# EAGLE design MIDItrigger (EAGLE 9.3.1)
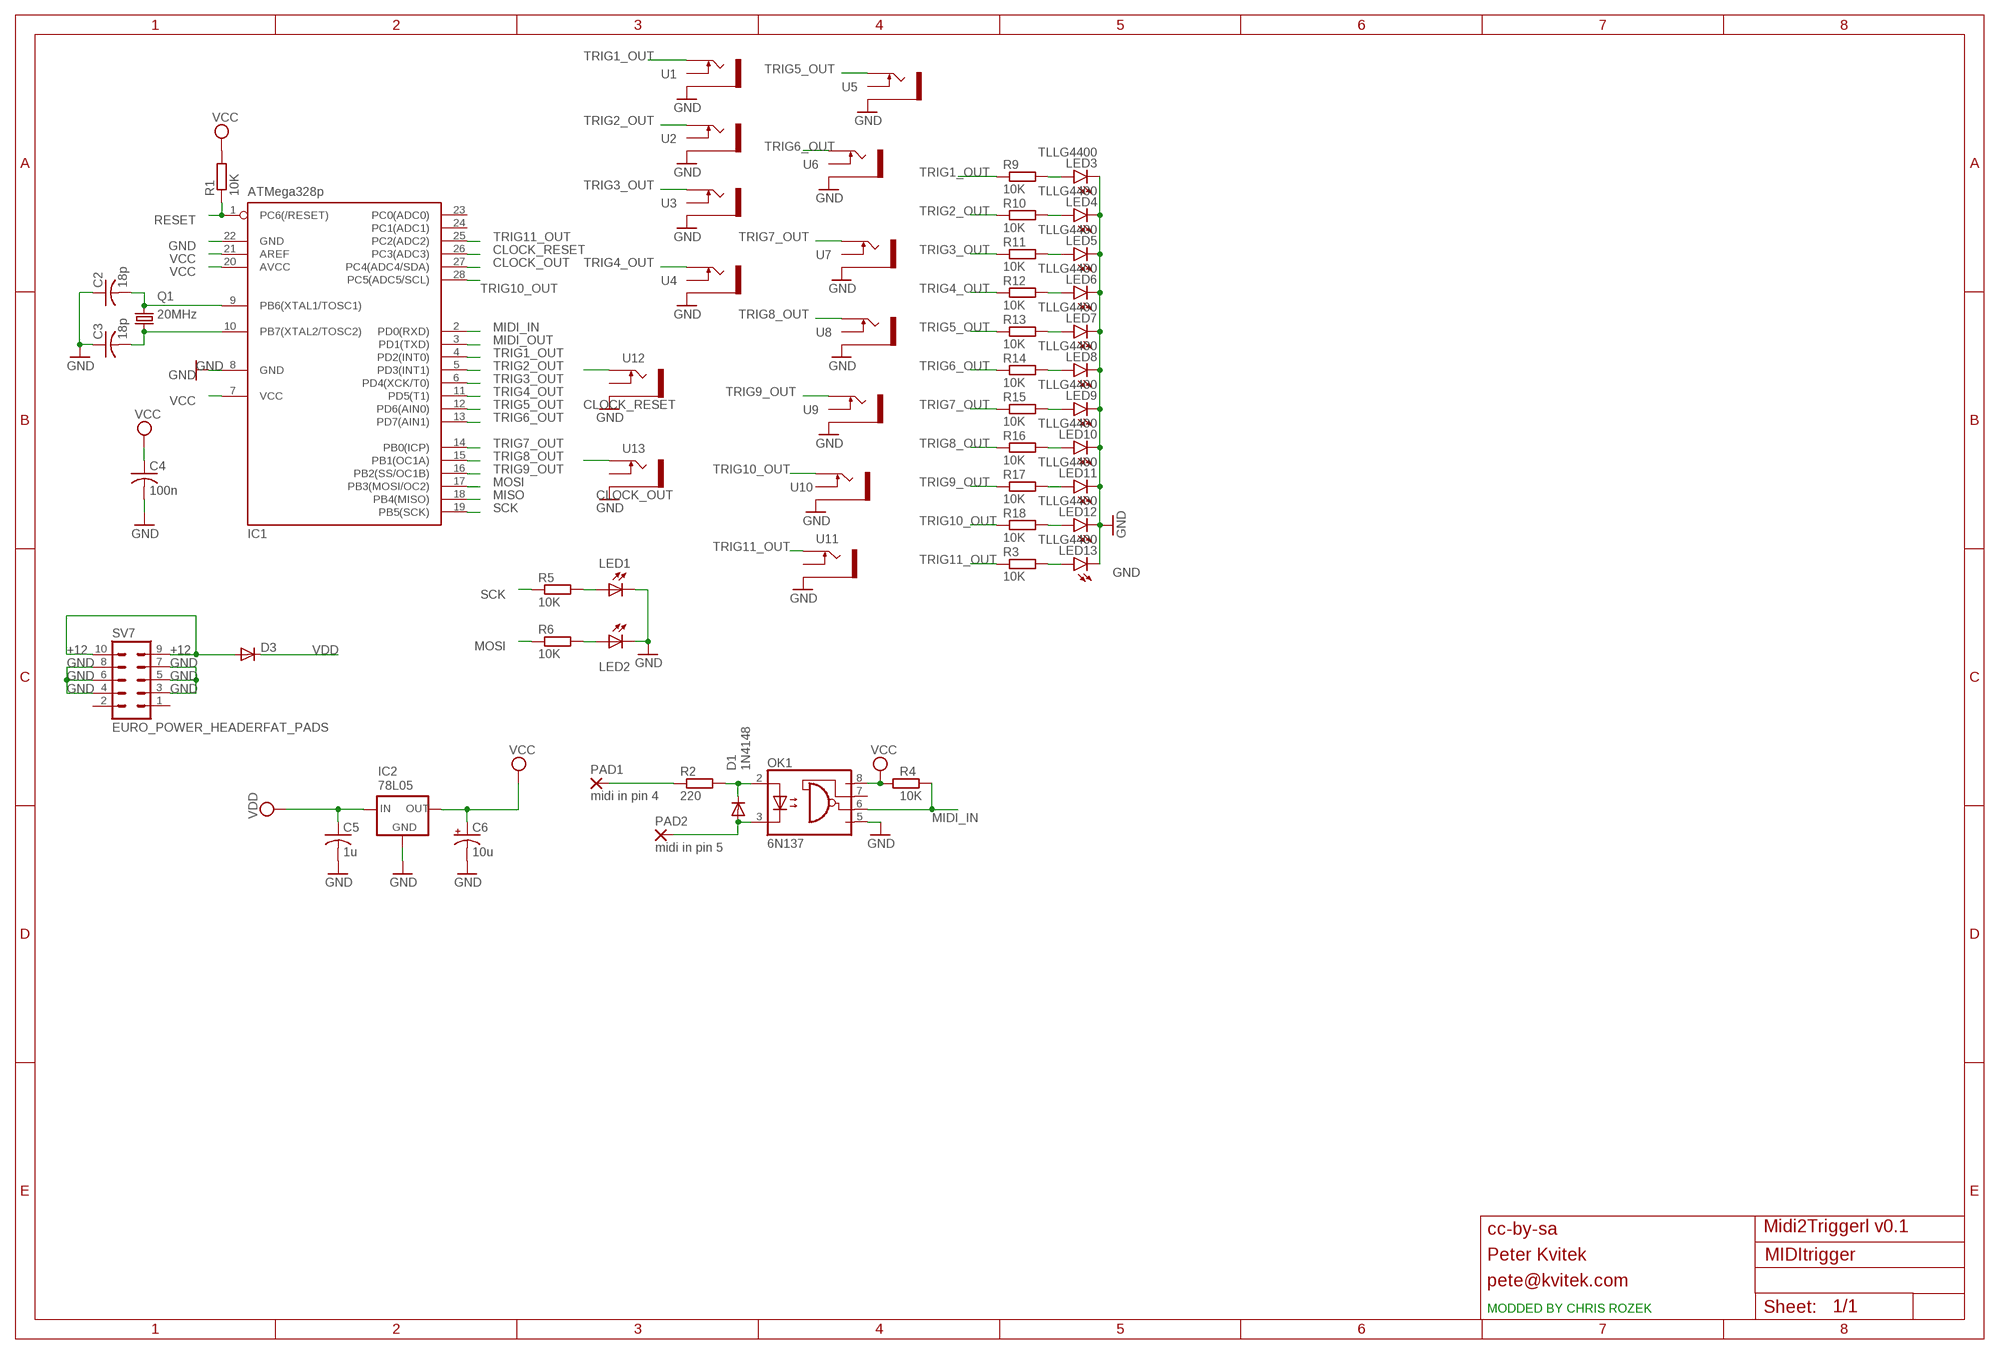
[diagram p0: schematic, sheet 1]

## Parts
C2  18p  C-US025-025X050  [C025-025X050]
C3  18p  C-US025-025X050  [C025-025X050]
C4  100n  C-US025-025X050  [C025-025X050]
C5  1u  C-US025-025X050  [C025-025X050]
C6  10u  CPOL-USE2.5-5  [E2,5-5]
D1  1N4148  SMALL_DIODEDO35-7  [DO35-7]
D3  SMALL_DIODEDO35-7  [DO35-7]
IC1  ATMega328p  MEGA8-P  [DIL28-3]
IC2  78L05  78LXX  [78LXX]
LED1  LED3MM  [LED3MM]
LED2  LED3MM  [LED3MM]
LED3  TLLG4400  [LED3MM]
LED4  TLLG4400  [LED3MM]
LED5  TLLG4400  [LED3MM]
LED6  TLLG4400  [LED3MM]
LED7  TLLG4400  [LED3MM]
LED8  TLLG4400  [LED3MM]
LED9  TLLG4400  [LED3MM]
LED10  TLLG4400  [LED3MM]
LED11  TLLG4400  [LED3MM]
LED12  TLLG4400  [LED3MM]
LED13  TLLG4400  [LED3MM]
OK1  6N137  [DIL08]
PAD1  midi in pin 4  2,54/1,1  [2,54/1,1]
PAD2  midi in pin 5  2,54/1,1  [2,54/1,1]
Q1  20MHz  CRYSTALHC49U-V  [HC49U-V]
R1  10K  RESISTORVERTICAL  [VERTICAL_RESISTOR]
R2  220  RESISTORVERTICAL  [VERTICAL_RESISTOR]
R3  10K  RESISTORVERTICAL  [VERTICAL_RESISTOR]
R4  10K  RESISTORVERTICAL  [VERTICAL_RESISTOR]
R5  10K  RESISTORVERTICAL  [VERTICAL_RESISTOR]
R6  10K  RESISTORVERTICAL  [VERTICAL_RESISTOR]
R9  10K  RESISTORVERTICAL  [VERTICAL_RESISTOR]
R10  10K  RESISTORVERTICAL  [VERTICAL_RESISTOR]
R11  10K  RESISTORVERTICAL  [VERTICAL_RESISTOR]
R12  10K  RESISTORVERTICAL  [VERTICAL_RESISTOR]
R13  10K  RESISTORVERTICAL  [VERTICAL_RESISTOR]
R14  10K  RESISTORVERTICAL  [VERTICAL_RESISTOR]
R15  10K  RESISTORVERTICAL  [VERTICAL_RESISTOR]
R16  10K  RESISTORVERTICAL  [VERTICAL_RESISTOR]
R17  10K  RESISTORVERTICAL  [VERTICAL_RESISTOR]
R18  10K  RESISTORVERTICAL  [VERTICAL_RESISTOR]
SV7  EURO_POWER_HEADERFAT_PADS  [EURO_PWR_HEADER_FAT]
U1  THONKICONNNEW  [WQP-PJ301M-12_JACK]
U2  THONKICONNNEW  [WQP-PJ301M-12_JACK]
U3  THONKICONNNEW  [WQP-PJ301M-12_JACK]
U4  THONKICONNNEW  [WQP-PJ301M-12_JACK]
U5  THONKICONNNEW  [WQP-PJ301M-12_JACK]
U6  THONKICONNNEW  [WQP-PJ301M-12_JACK]
U7  THONKICONNNEW  [WQP-PJ301M-12_JACK]
U8  THONKICONNNEW  [WQP-PJ301M-12_JACK]
U9  THONKICONNNEW  [WQP-PJ301M-12_JACK]
U10  THONKICONNNEW  [WQP-PJ301M-12_JACK]
U11  THONKICONNNEW  [WQP-PJ301M-12_JACK]
U12  THONKICONNNEW  [WQP-PJ301M-12_JACK]
U13  THONKICONNNEW  [WQP-PJ301M-12_JACK]

## Nets
+12: D3.A SV7.9 SV7.10
CLOCK_OUT: IC1.27(PC4(ADC4/SDA)) U13.P$1_TIP(TIP)
CLOCK_RESET: IC1.26(PC3(ADC3)) U12.P$1_TIP(TIP)
GND: C2.1 C3.1 C4.2 C5.2 C6.- IC1.8(GND) IC1.22(GND) IC2.GND LED1.K(C) LED2.K(C) LED3.K(C) LED4.K(C) LED5.K(C) LED6.K(C) LED7.K(C) LED8.K(C) LED9.K(C) LED10.K(C) LED11.K(C) LED12.K(C) LED13.K(C) OK1.5(GND) SV7.3 SV7.4 SV7.5 SV7.6 SV7.7 SV7.8 U1.P$3_SLEEVE(SLEEVE) U2.P$3_SLEEVE(SLEEVE) U3.P$3_SLEEVE(SLEEVE) U4.P$3_SLEEVE(SLEEVE) U5.P$3_SLEEVE(SLEEVE) U6.P$3_SLEEVE(SLEEVE) U7.P$3_SLEEVE(SLEEVE) U8.P$3_SLEEVE(SLEEVE) U9.P$3_SLEEVE(SLEEVE) U10.P$3_SLEEVE(SLEEVE) U11.P$3_SLEEVE(SLEEVE) U12.P$3_SLEEVE(SLEEVE) U13.P$3_SLEEVE(SLEEVE)
MIDI_IN: IC1.2(PD0(RXD)) OK1.6(VO) R4.2
MIDI_OUT: IC1.3(PD1(TXD))
MISO: IC1.18(PB4(MISO))
MOSI: IC1.17(PB3(MOSI/OC2)) R6.1
N$2: D1.C OK1.2(A) R2.2
N$3: LED13.A R3.2
N$4: LED1.A R5.2
N$5: LED2.A R6.2
N$17: LED3.A R9.2
N$18: LED4.A R10.2
N$19: LED5.A R11.2
N$20: LED6.A R12.2
N$21: LED7.A R13.2
N$22: LED8.A R14.2
N$23: LED9.A R15.2
N$24: LED10.A R16.2
N$25: LED11.A R17.2
N$26: LED12.A R18.2
N$72: PAD1.1(P) R2.1
N$73: D1.A OK1.3(C) PAD2.1(P)
N$82: C3.2 IC1.10(PB7(XTAL2/TOSC2)) Q1.1
N$83: C2.2 IC1.9(PB6(XTAL1/TOSC1)) Q1.2
RESET: IC1.1(PC6(/RESET)) R1.1
SCK: IC1.19(PB5(SCK)) R5.1
TRIG1_OUT: IC1.4(PD2(INT0)) R9.1 U1.P$1_TIP(TIP)
TRIG2_OUT: IC1.5(PD3(INT1)) R10.1 U2.P$1_TIP(TIP)
TRIG3_OUT: IC1.6(PD4(XCK/T0)) R11.1 U3.P$1_TIP(TIP)
TRIG4_OUT: IC1.11(PD5(T1)) R12.1 U4.P$1_TIP(TIP)
TRIG5_OUT: IC1.12(PD6(AIN0)) R13.1 U5.P$1_TIP(TIP)
TRIG6_OUT: IC1.13(PD7(AIN1)) R14.1 U6.P$1_TIP(TIP)
TRIG7_OUT: IC1.14(PB0(ICP)) R15.1 U7.P$1_TIP(TIP)
TRIG8_OUT: IC1.15(PB1(OC1A)) R16.1 U8.P$1_TIP(TIP)
TRIG9_OUT: IC1.16(PB2(SS/OC1B)) R17.1 U9.P$1_TIP(TIP)
TRIG10_OUT: IC1.28(PC5(ADC5/SCL)) R18.1 U10.P$1_TIP(TIP)
TRIG11_OUT: IC1.25(PC2(ADC2)) R3.1 U11.P$1_TIP(TIP)
VCC: C4.1 C6.+ IC1.7(VCC) IC1.20(AVCC) IC1.21(AREF) IC2.OUT OK1.8(VCC) R1.2 R4.1
VDD: C5.1 D3.C IC2.IN
Unconnected: IC1.23(PC0(ADC0)) IC1.24(PC1(ADC1)) OK1.7(VE) SV7.1 SV7.2 U1.P$2_SWITCH(SWITCH) U2.P$2_SWITCH(SWITCH) U3.P$2_SWITCH(SWITCH) U4.P$2_SWITCH(SWITCH) U5.P$2_SWITCH(SWITCH) U6.P$2_SWITCH(SWITCH) U7.P$2_SWITCH(SWITCH) U8.P$2_SWITCH(SWITCH) U9.P$2_SWITCH(SWITCH) U10.P$2_SWITCH(SWITCH) U11.P$2_SWITCH(SWITCH) U12.P$2_SWITCH(SWITCH) U13.P$2_SWITCH(SWITCH)

## Notes on the sheet
- cc-by-sa | Midi2Triggerl v0.1
- Peter Kvitek
- pete@kvitek.com
- MODDED BY CHRIS ROZEK

## Library data of the parts
C2-C5 = rcl:C-US: CAPACITOR, American symbol
C6 = rcl:CPOL-US: POLARIZED CAPACITOR, American symbol
D1 D3 = MusicThingModular:SMALL_DIODE: Small Signal Diode
IC1 = atmel:MEGA8-P: MICROCONTROLLER 8 Kbytes FLASH, 1 kbytes SRAM, 512 bytes EEPROM, USART, 4-channel 10 bit ADC, 2-channel 8 bit ADC Pin compatible with Atmega48, ATMega88, ATMega168 Source: avr.lbr; OC_FARNELL: unknown; OC_NEWARK: unknown
IC2 = v-reg:78LXX: VOLTAGE REGULATOR
LED1 LED2 = led:LED: LED OSRAM: - CHIPLED LG R971, LG N971, LY N971, LG Q971, LY Q971, LO R971, LY R971 LH N974, LH R974 LS Q976, LO Q976, LY Q976 LO Q996 - Hyper CHIPLED LW Q18S LB Q993, LB Q99A, LB R99A - SideLED LS A670, LO A670, LY A670, LG A670, LP A670 LB A673, LV A673, LT A673, LW A673 LH A674 LY A675 LS A676, LA A676, LO A676, LY A676, LW A676 LS A679, LY A679, LG A679 - Hyper Micro SIDELED® LS Y876, LA Y876, LO Y876, LY Y876 LT Y87S - SmartLED LW L88C, LW L88S LB L89C, LB L89S, LG L890 LS L89K, LO L89K, LY L89K LS L896, LA L896, LO L896, LY L896 - TOPLED LS T670, LO T670, LY T670, LG T670, LP T670 LSG T670, LSP T670, LSY T670, LOP T670, LYG T670 LG T671, LOG T671, LSG T671 LB T673, LV T673, LT T673, LW T673 LH T674 LS T676, LA T676, LO T676, LY T676, LB T676, LH T676, LSB T676, LW T676 LB T67C, LV T67C, LT T67C, LS T67K, LO T67K, LY T67K, LW E67C LS E67B, LA E67B, LO E67B, LY E67B, LB E67C, LV E67C, LT E67C LW T67C LS T679, LY T679, LG T679 LS T770, LO T770, LY T770, LG T770, LP T770 LB T773, LV T773, LT T773, LW T773 LH T774 LS E675, LA E675, LY E675, LS T675 LS T776, LA T776, LO T776, LY T776, LB T776 LHGB T686 LT T68C, LB T68C - Hyper Mini TOPLED® LB M676 - Mini TOPLED Santana® LG M470 LS M47K, LO M47K, LY M47K Source: http://www.osram.convergy.de LUXEON: - LUMILED® LXK2-PW12-R00, LXK2-PW12-S00, LXK2-PW14-U00, LXK2-PW14-V00 LXK2-PM12-R00, LXK2-PM12-S00, LXK2-PM14-U00 LXK2-PE12-Q00, LXK2-PE12-R00, LXK2-PE12-S00, LXK2-PE14-T00, LXK2-PE14-U00 LXK2-PB12-K00, LXK2-PB12-L00, LXK2-PB12-M00, LXK2-PB14-N00, LXK2-PB14-P00, LXK2-PB14-Q00 LXK2-PR12-L00, LXK2-PR12-M00, LXK2-PR14-Q00, LXK2-PR14-R00 LXK2-PD12-Q00, LXK2-PD12-R00, LXK2-PD12-S00 LXK2-PH12-R00, LXK2-PH12-S00 LXK2-PL12-P00, LXK2-PL12-Q00, LXK2-PL12-R00 Source: www.luxeon.com KINGBRIGHT: KA-3528ASYC Source: www.kingbright.com
LED3-LED13 = led:TLLG4400: Low Current (2mA) LED 3 mm Tinted Diffused Package color GREEN Source: Data sheet <http://www.farnell.com/datasheets/391098.pdf>; MF: VISHAY SEMICONDUCTOR; OC_FARNELL: 1612435
OK1 = kvitekp:6N137: MOTOROLA OPTO COUPLER; MPN: 6N137; OC_FARNELL: 1328376; OC_NEWARK: 52M1895
PAD1 PAD2 = wirepad:2,54/1,1: THROUGH-HOLE PAD
Q1 = crystal:CRYSTAL: CRYSTAL; OC_FARNELL: 1666969; OC_NEWARK: unknown
R1-R6 R9-R18 = MusicThingModular:RESISTOR: Standard resistor, various versions
SV7 = MusicThingModular:EURO_POWER_HEADER: Power Header 10 pin power header for Eurorack Power Supplies Variants with fatter pads for easier soldering, and the LOCK variant which has 5mil offset pins to hold the component in place before soldering
U1-U13 = MusicThingModular:THONKICONN: 3.5mm socket for Eurorack modular synths

## Net classes
0 default: width 0.635 mm, drill 0.254 mm, clearance 0.254 mm
1 bigger: width 1.27 mm, drill 0.508 mm, clearance 0.635 mm

## Board
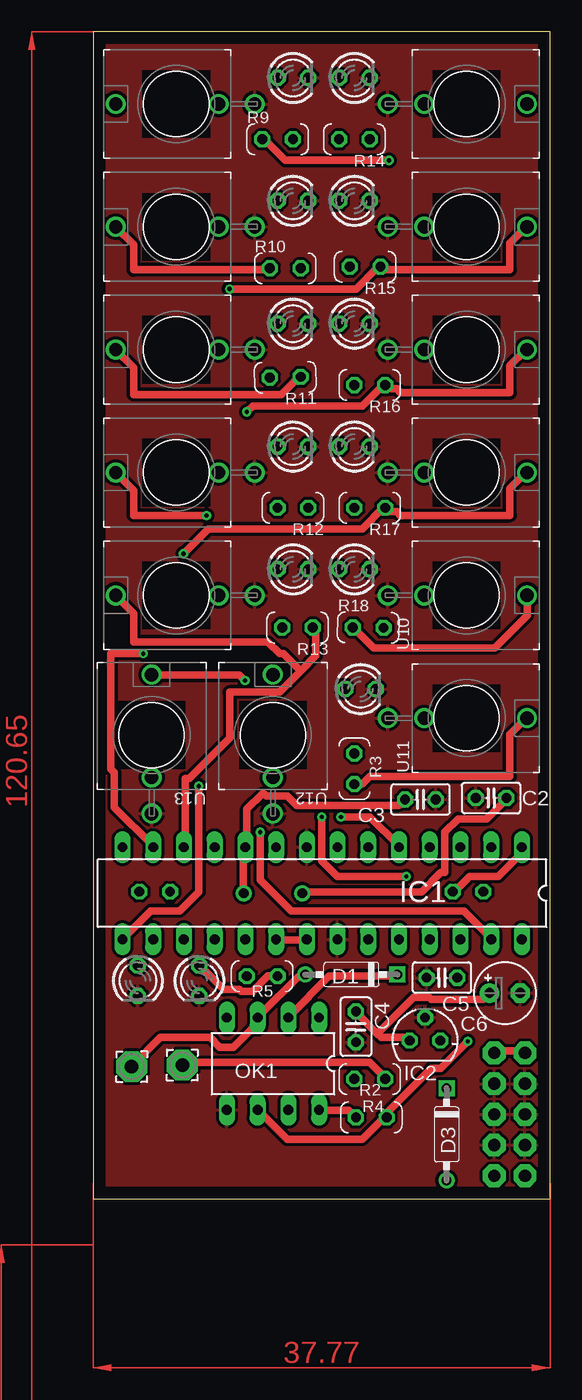
[diagram p1: board, top side]
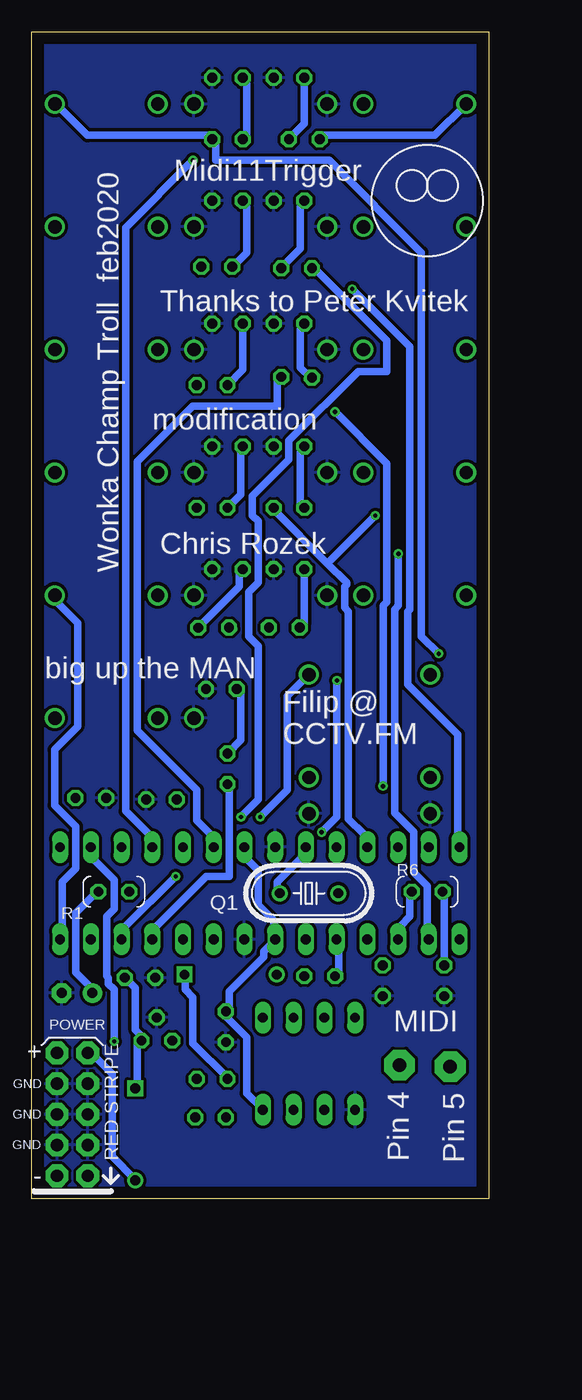
[diagram p2: board, bottom side, seen from below]

Size 37.77 x 96.51 mm. Coordinates in mm from the lower left corner, seen from the top.
Outline: 0,0 37.77,0 37.77,96.51 0,96.51 0,0
Copper layers (1*16): Top 0.035mm / dielectric 1.5mm / Bottom 0.035mm
Design rules "default": minimum track width 6mil, minimum drill 0.35mm, track to track 6mil, track to pad 6mil, pad to pad 6mil, via to via 6mil, smd to smd 6mil, copper to edge 40mil, drill to drill 6mil, minimum pad ring 10mil, minimum via ring 8mil, stop-mask expansion 4mil, vias tented up to drill 0mil, thermal gap 10mil

### Footprints (pad centres in the part's own frame; a part is rotated, then mirrored left to right if it is on the bottom)
C025-025X050 = drill 0.813 octagon: 1 -1.27,0; 2 1.27,0
E2,5-5 = drill 0.813 pad 1.6: + -1.27,0 | drill 0.813 pad 1.6 octagon: - 1.27,0
DO35-7 = drill 0.813: A 3.81,0 | drill 0.813 square: C -3.81,0
DIL28-3 = drill 0.813 long: 1 -16.51,-3.81; 2 -13.97,-3.81; 3 -11.43,-3.81; 4 -8.89,-3.81; 5 -6.35,-3.81; 6 -3.81,-3.81; 7 -1.27,-3.81; 8 1.27,-3.81; 9 3.81,-3.81; 10 6.35,-3.81; 11 8.89,-3.81; 12 11.43,-3.81; 13 13.97,-3.81; 14 16.51,-3.81; 15 16.51,3.81; 16 13.97,3.81; 17 11.43,3.81; 18 8.89,3.81; 19 6.35,3.81; 20 3.81,3.81; 21 1.27,3.81; 22 -1.27,3.81; 23 -3.81,3.81; 24 -6.35,3.81; 25 -8.89,3.81; 26 -11.43,3.81; 27 -13.97,3.81; 28 -16.51,3.81
78LXX = drill 0.813 octagon: GND 0,1.905; IN 1.27,0; OUT -1.27,0
LED3MM = drill 0.813 octagon: A -1.27,0; K 1.27,0
DIL08 = drill 0.813 long: 1 -3.81,-3.81; 2 -1.27,-3.81; 3 1.27,-3.81; 4 3.81,-3.81; 5 3.81,3.81; 6 1.27,3.81; 7 -1.27,3.81; 8 -3.81,3.81
2,54/1,1 = drill 1.118 pad 2.54 octagon: 1 0,0
HC49U-V = drill 0.813: 1 -2.413,0; 2 2.413,0
VERTICAL_RESISTOR = drill 0.813 octagon: 1 -1.27,0; 2 1.27,0
EURO_PWR_HEADER_FAT = drill 1.016 pad 1.88 octagon: 1 -5.08,-1.27; 2 -5.08,1.27; 3 -2.54,-1.27; 4 -2.54,1.27; 5 0,-1.27; 6 0,1.27; 7 2.54,-1.27; 8 2.54,1.27; 9 5.08,-1.27; 10 5.08,1.27
WQP-PJ301M-12_JACK = drill 1.1: P$1_TIP 0,5; P$2_SWITCH 0,-3.5; P$3_SLEEVE 0,-6.5

### Placement (x,y rotation side)
C2  32.89,33.15 0 top
C3  27.05,33.02 180 top
C4  21.72,14.22 270 top
C5  28.83,18.29 180 top
C6  34.04,17.02 0 top
D1  21.34,18.54 180 top
D3  29.21,5.33 270 top
IC1  18.92,25.27 180 top
IC2  27.43,13.08 0 top
LED1  8.76,18.03 270 top
LED2  3.68,18.03 270 top
LED3  16.51,92.71 0 top
LED4  16.51,82.55 0 top
LED5  16.51,72.39 0 top
LED6  16.51,62.23 0 top
LED7  16.51,52.07 0 top
LED8  21.59,92.71 0 top
LED9  21.59,82.55 0 top
LED10  21.59,72.39 0 top
LED11  21.59,62.23 0 top
LED12  21.59,52.07 0 top
LED13  22.1,42.16 0 top
OK1  14.86,11.18 180 top
PAD1  7.37,11.05 0 top
PAD2  3.17,10.92 0 top
Q1  14.86,25.27 180 bottom
R1  30.99,25.4 180 bottom
R2  22.86,9.91 180 top
R3  21.59,35.56 90 top
R4  22.99,6.73 0 top
R5  13.97,18.42 0 top
R6  5.08,25.4 0 bottom
R9  15.24,87.63 0 top
R10  15.88,76.96 0 top
R11  15.88,67.95 181.3 top
R12  16.51,57.15 180 top
R13  16.89,47.24 180 top
R14  21.59,87.63 180 top
R15  22.48,77.09 180 top
R16  22.86,67.31 180 top
R17  22.86,57.15 180 top
R18  22.73,47.24 359.2 top
SV7  34.42,6.98 90 bottom
U1  6.86,90.55 90 top
U2  6.86,80.39 90 top
U3  6.86,70.23 90 top
U4  6.86,60.07 90 top
U5  6.86,49.91 90 top
U6  30.86,90.55 270 top
U7  30.86,80.39 270 top
U8  30.86,70.23 270 top
U9  30.86,60.07 270 top
U10  30.86,49.91 270 top
U11  30.86,39.75 270 top
U12  14.86,38.35 0 top
U13  4.83,38.35 0 top

### Tracks (layer width: path | path; a pad name or v marks a point on that pad's centre or on a via)
+12
  Top 0.635: SV7.10 35.56,12.07 35.4,12.22 33.34,12.22 33.18,12.07 SV7.9
  Bottom 0.635: SV7.9 32.86,12.07 31.11,10.32 31.11,3.49 29.21,1.59 D3.A
CLOCK_OUT  (via drill 0.35)
  Top 0.635: v13.81,30.32 13.81,26.35 16.35,23.81 30.64,23.81 32.86,21.59 IC1.27 | v12.54,42.86 12.06,43.34 4.92,43.34 U13.P$1_TIP
  Bottom 0.635: v13.81,30.32 12.54,31.59 v12.54,42.86
CLOCK_RESET  (via drill 0.35)
  Top 0.635: v25.88,26.67 20.16,26.67 18.89,27.94 v18.89,31.59
  Bottom 0.635: v25.88,26.67 30.16,22.38 30.16,21.75 30.32,21.59 IC1.26 | v18.89,31.59 16.67,33.81 16.67,41.59 14.92,43.34 U12.P$1_TIP
GND
  pour Top: -1.27,99.06 39.37,99.06 40.64,100.33 40.64,-7.62 0,-7.62 -1.27,-6.35
  pour Bottom: 0,96.52 38.1,96.52 38.1,0 0,0
MIDI_IN  (via drill 0.35)
  Top 0.635: OK1.6 16.03,4.92 22.23,4.92 23.97,6.67 24.13,6.67 R4.2 24.13,6.98 27.94,10.79 28.73,10.79 v30.96,13.02
  Bottom 0.635: IC1.2 32.7,28.89 32.7,28.1 30.96,26.35 30.96,23.97 31.59,23.34 31.59,18.42 31.43,18.26 31.43,17.78 30.96,17.3 v30.96,13.02
MOSI
  Bottom 0.635: R6.1 6.51,25.24 6.51,23.34 7.3,22.54 7.3,21.75 7.46,21.59 IC1.17
N$2
  Top 0.635: OK1.2 16.19,15.08 19.53,18.42 25.08,18.42 D1.C
  Bottom 0.635: R2.2 21.59,10 24.45,12.86 24.45,16.67 25.08,17.3 25.08,18.42 D1.C
N$3
  Bottom 0.635: R3.2 20.48,37.94 20.48,41.75 20.8,42.07 LED13.A
N$4
  Top 0.635: R5.2 14.45,18.42 13.18,17.14 12.22,17.14 12.06,17.3 10.79,17.3 8.89,19.21 LED1.A
N$5
  Bottom 0.635: R6.2 3.65,25.24 3.65,19.37 LED2.A
N$17
  Bottom 0.635: R9.2 15.24,88.9 LED3.A
N$18
  Bottom 0.635: LED4.A 15.24,82.39 15.56,82.07 15.56,78.58 17.14,76.99 R10.2
N$19
  Bottom 0.635: LED5.A 15.24,72.23 15.56,71.91 15.56,68.74 14.76,67.95 R11.2
N$20
  Bottom 0.635: R12.2 15.56,57.47 15.56,61.75 15.24,62.07 LED6.A
N$21
  Bottom 0.635: R13.2 15.24,47.62 LED7.A
N$22
  Bottom 0.635: R14.2 20,87.95 20,92.23 20.32,92.55 LED8.A
N$23
  Bottom 0.635: LED9.A 20.32,82.39 20,82.07 20,78.26 21.11,77.15 R15.2
N$24
  Bottom 0.635: R16.2 20.32,68.58 LED10.A
N$25
  Bottom 0.635: R17.2 20.48,58.26 20.48,62.07 LED11.A
N$26
  Bottom 0.635: LED12.A 20.32,51.91 20.64,51.59 20.64,50.64 23.97,47.31 R18.2
N$72
  Top 0.635: R2.1 24.13,10 22.86,11.27 7.62,11.27 7.46,11.11 PAD1.1
N$73
  Top 0.635: D1.A 17.46,18.57 17.14,18.57 13.65,15.08 OK1.3 13.81,14.76 11.59,12.54 10.48,12.54 9.68,13.34 5.56,13.34 3.17,10.95 PAD2.1
N$82
  Top 0.635: Q1.1 12.38,25.4 12.38,29.05 12.54,29.05 IC1.10 12.7,29.37 12.7,32.23 13.97,33.5 14.13,33.5 14.29,33.34 16.03,33.34 16.83,32.54 25.24,32.54 25.72,33.02 C3.2
N$83
  Top 0.635: C2.2 34.13,33.02 32.54,31.43 30.16,31.43 29.05,30.32 29.05,26.99 28.73,26.99 27.15,25.4 17.3,25.4 Q1.2
  Bottom 0.635: IC1.9 15.24,29.05 15.4,28.89 15.4,28.26 17.46,26.19 17.46,25.56 17.3,25.4 Q1.2
RESET
  Top 0.635: R1.1 29.84,25.4 31.11,26.67 33.5,26.67 35.4,28.57 35.4,29.05 IC1.1
SCK
  Bottom 0.635: R5.1 12.38,18.73 12.38,20.32 12.54,20.48 12.54,21.43 IC1.19
TRIG1_OUT  (via drill 0.35)
  Top 0.635: v24.45,85.88 15.88,85.88 14.13,87.63 R9.1
  Bottom 0.635: IC1.4 28.1,29.37 28.1,30.16 30,32.07 30,80.33 v24.45,85.88 | R9.1 13.97,87.95 4.45,87.95 1.91,90.49 U1.P$1_TIP
TRIG2_OUT  (via drill 0.35)
  Top 0.635: v20.48,31.59 22.86,31.59 25.24,29.21 IC1.5 | U2.P$1_TIP 1.91,80.33 3.33,78.9 3.33,76.84 14.61,76.84 R10.1
  Bottom 0.635: v20.48,31.59 19.05,33.02 19.05,45.72 19.84,46.51 19.84,50.17 19.05,50.96 19.05,56.04 19.53,56.52 19.53,58.1 16.51,61.12 16.51,62.71 10.79,68.42 8.41,68.42 8.41,70.96 14.29,76.84 14.61,76.84 R10.1
TRIG3_OUT
  Top 0.635: U3.P$1_TIP 1.91,70.17 3.33,68.74 3.33,66.52 15.56,66.52 16.99,67.95 R11.1
  Bottom 0.635: IC1.6 23.02,29.37 23.02,30.16 24.13,31.27 24.13,33.81 29.05,38.73 29.05,60.96 24.45,65.56 17.46,65.56 17.46,67.63 17.14,67.95 R11.1
TRIG4_OUT  (via drill 0.35)
  Top 0.635: v9.37,56.52 3.33,56.52 3.33,58.58 1.91,60.01 U4.P$1_TIP
  Bottom 0.635: IC1.11 10.32,29.37 10.32,30.16 11.59,31.43 11.59,48.58 11.91,48.9 11.91,50.64 11.75,50.8 11.75,50.96 13.34,52.55 | 13.34,52.55 17.78,56.99 R12.1 | 13.34,52.55 v9.37,56.52
TRIG5_OUT
  Top 0.635: 17.14,43.66 18.41,44.93 18.41,47.15 18.26,47.15 R13.1 | 17.14,43.66 15.4,41.91 11.27,41.91 11.27,38.1 7.94,34.77 7.62,34.77 7.62,29.21 IC1.12 | 17.14,43.66 15.72,45.09 15.4,45.09 14.45,46.04 3.33,46.04 3.33,48.42 1.91,49.85 U5.P$1_TIP
TRIG6_OUT  (via drill 0.35)
  Top 0.635: v4.13,45.09 1.43,45.09 1.43,35.56 1.75,35.24 1.75,32.39 4.92,29.21 IC1.13
  Bottom 0.635: v4.13,45.09 5.56,46.51 5.56,78.26 13.18,85.88 22.54,85.88 22.54,87.15 22.86,87.47 R14.1 23.02,87.79 23.02,87.95 33.18,87.95 35.72,90.49 U6.P$1_TIP
TRIG7_OUT  (via drill 0.35)
  Top 0.635: v11.27,75.25 21.75,75.25 23.5,76.99 23.65,76.99 R15.1 23.81,76.84 34.45,76.84 34.45,79.06 35.72,80.33 U7.P$1_TIP
  Bottom 0.635: v11.27,75.25 6.51,70.48 6.51,48.74 6.67,48.58 6.67,42.55 2.54,38.42 2.54,29.21 IC1.14
TRIG8_OUT  (via drill 0.35)
  Top 0.635: IC1.15 4.76,23.81 7.14,23.81 8.73,25.4 v8.73,34.13 | v12.7,65.09 13.18,65.56 22.23,65.56 23.97,67.31 R16.1 23.97,66.99 25.08,66.99 25.4,66.68 34.45,66.68 34.45,68.9 35.72,70.17 U8.P$1_TIP
  Bottom 0.635: v8.73,34.13 8.73,49.05 8.41,49.37 8.41,60.8 v12.7,65.09
TRIG9_OUT  (via drill 0.35)
  Top 0.635: v7.46,53.34 9.53,55.4 22.23,55.4 23.97,57.15 R17.1 23.97,56.83 25.08,56.83 25.4,56.52 34.45,56.52 34.45,58.74 35.72,60.01 U9.P$1_TIP
  Bottom 0.635: v7.46,53.34 7.46,49.05 7.78,48.74 7.78,31.91 6.19,30.32 6.19,26.99 5.08,25.88 5.08,21.59 IC1.16
TRIG10_OUT
  Top 0.635: R18.1 21.59,47.15 23.18,45.56 33.18,45.56 35.88,48.26 35.88,49.85 U10.P$1_TIP
  Bottom 0.635: IC1.28 35.4,21.59 35.24,21.75 35.24,26.19 34.13,27.31 34.13,30.8 35.88,32.54 35.88,37.15 33.97,39.05 33.97,47.62 35.72,49.37 35.72,49.85 U10.P$1_TIP
TRIG11_OUT
  Top 0.635: R3.1 22.23,34.29 22.86,34.92 34.45,34.92 34.45,38.42 35.72,39.69 U11.P$1_TIP
  Bottom 0.635: R3.1 21.43,34.13 21.43,26.67 23.34,26.67 27.62,22.38 27.62,21.75 27.78,21.59 IC1.25
VCC
  Top 0.635: IC1.20 15.24,21.43 17.62,21.43 IC1.21 | R4.1 21.59,6.83 21.11,7.3 18.73,7.3 OK1.8 | 23.5,13.65 23.81,13.34 25.72,13.34 25.88,13.18 26.04,13.18 IC2.OUT | 23.5,13.65 21.75,15.4 C4.1 | 23.5,13.65 26.51,16.67 27.78,16.67 27.94,16.51 32.23,16.51 32.7,16.99 C6.+
  Bottom 0.635: IC1.7 20,28.89 20,28.1 19.05,27.15 19.05,24.29 17.78,23.02 17.78,21.59 IC1.21 17.78,21.27 18.57,20.48 18.57,20 21.43,17.14 21.43,15.56 C4.1 21.75,15.4 21.75,15.08 20,13.34 20,8.73 18.73,7.46 OK1.8 | R1.2 32.38,25.4 34.13,23.65 34.13,18.73 32.86,17.46 32.86,17.14 C6.+
VDD
  Bottom 0.635: D3.C 29.21,9.21 29.05,9.37 29.05,12.7 28.73,13.02 IC2.IN 28.73,13.34 28.73,13.49 29.21,13.97 29.21,17.46 30,18.26 C5.1
(copper drawn outside any net)
  shapes: Top area x4

### Text on the board
bNames: Midi11Trigger | feb2020 | Thanks to Peter Kvitek | modification | Chris Rozek | Wonka Champ Troll | big up the MAN | Filip @ / CCTV.FM | MIDI | Pin 5 | Pin 4